# Altium schematic sheet Remot.SchDoc: GSM
size A4; SheetNumber: 1; SheetTotal: 1
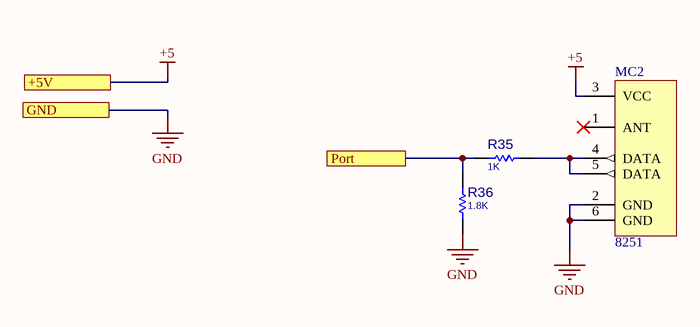
[diagram p0: Remot.SchDoc]

## Parts
MC2  Inflow: 8251  [RF_ETRXB]  (hidden comment: RXB22)
R35  1K  [R0805]
R36  1.8K  [R0805]

## Ports
+5V, GND, Port

## Nets
+5: MC2.3(VCC) ; port +5V
GND: MC2.2(GND) MC2.6(GND) R36.1 ; port GND
Port: R35.2 R36.2 ; port Port
NetMC2_4: MC2.4(DATA) MC2.5(DATA) R35.1

Not connected (* = marked no-connect by the designer): MC2 1(ANT)*

## Notes on the sheet
- Title:
- Project:
- Drawn by:
- Revision:
- Hossein Bagheri
- Company:
- Sheet
- of

## Library data of the parts
MC2 = ModSen_Com_RXB22_433: JMR RXB22 433MHz ASK superheterodyne wireless receiving module; Rating: 433M; Validation: Valid; Value: RXB22; Package: Dip; Type: Learning
R35 R36 = RES_SMD_0805: RESISTOR, SMD; PARAM: -W; DESC: DESCRIPTION; DIST#: MOUSER; PARAM2: 1%; MANF_P#: -; MANF: -; ASSEMBLY: ASSEMBLY; PRICE: 100= 0.5$
  R35: VALUE: 1K
  R36: VALUE: 1.8K